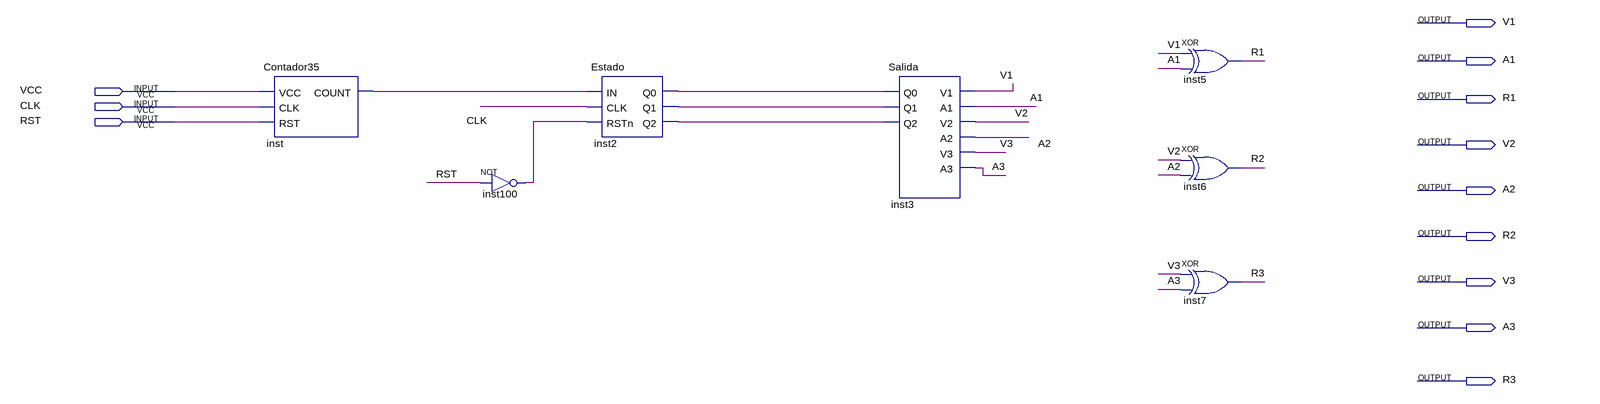
[diagram p0: schematic sheet]
// Quartus schematic Semaforo.bdf as structural Verilog: 7 symbols, 12 pins
module Semaforo (
  input  VCC,
  input  CLK,
  input  RST,
  output V1,
  output A1,
  output R1,
  output V2,
  output A2,
  output R2,
  output V3,
  output A3,
  output R3
);

  wire inst2_q0, inst2_q1, inst2_q2, inst100_out, inst_count;

  Contador35 inst (.VCC(VCC), .CLK(CLK), .RST(RST), .COUNT(inst_count));
  not inst100 (inst100_out, RST);
  Estado inst2 (.IN(inst_count), .CLK(CLK), .RSTn(inst100_out), .Q0(inst2_q0), .Q1(inst2_q1), .Q2(inst2_q2));
  Salida inst3 (.Q0(inst2_q0), .Q1(inst2_q1), .Q2(inst2_q2), .V1(V1), .A1(A1), .V2(V2), .A2(A2), .V3(V3), .A3(A3));
  xor inst5 (R1, V1, A1);
  xor inst6 (R2, V2, A2);
  xor inst7 (R3, V3, A3);
endmodule
